# Altium project BaseBoard.PrjPcb (part 1 of 2)
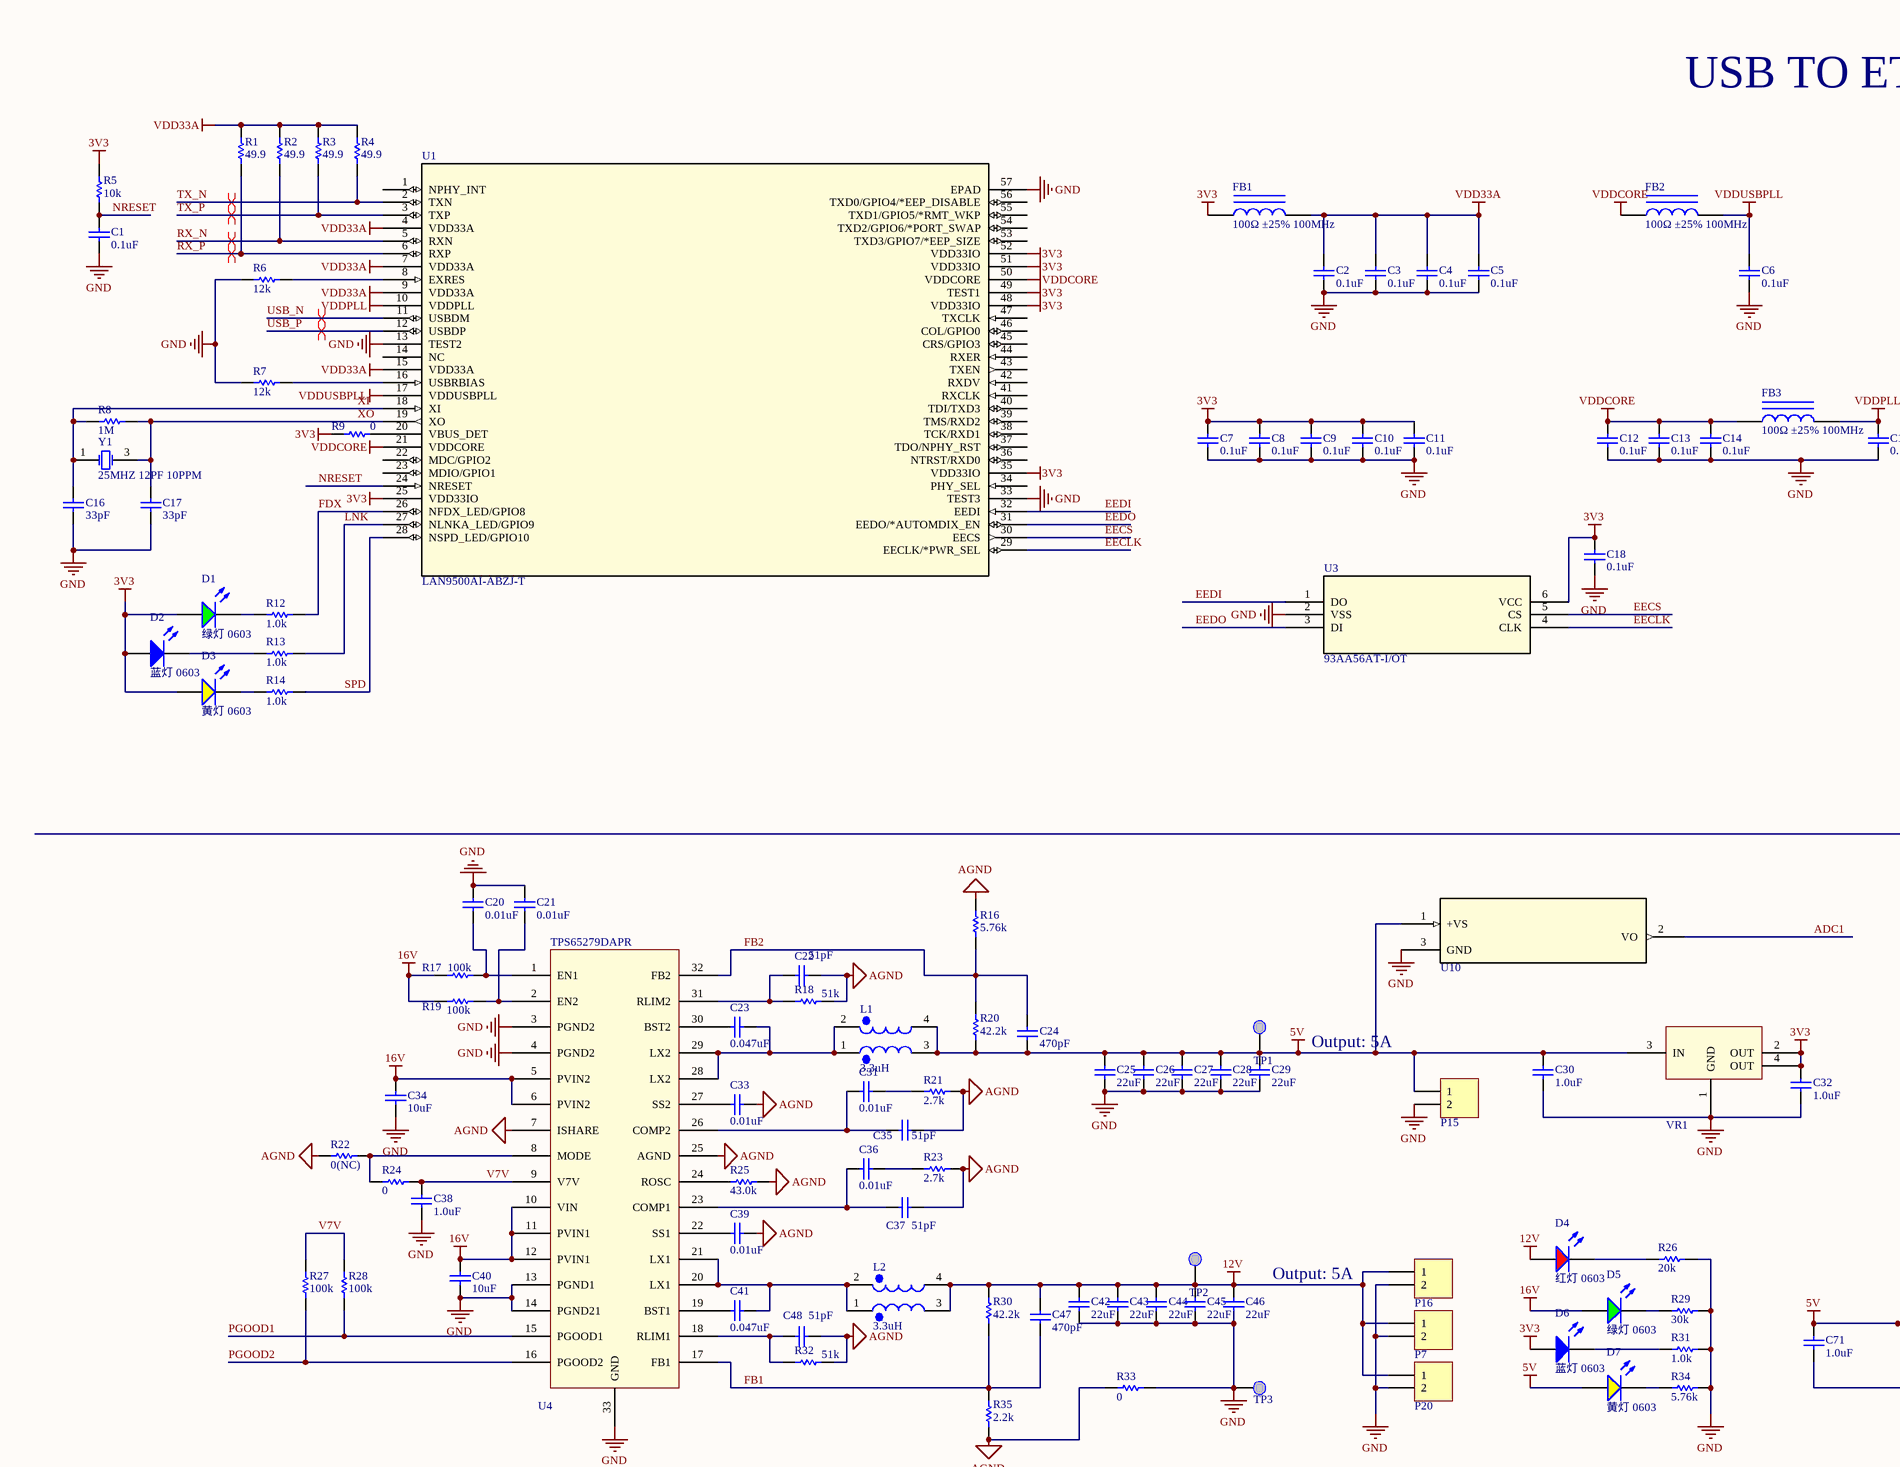
[diagram p0: BaseBoard.SchDoc, top left]
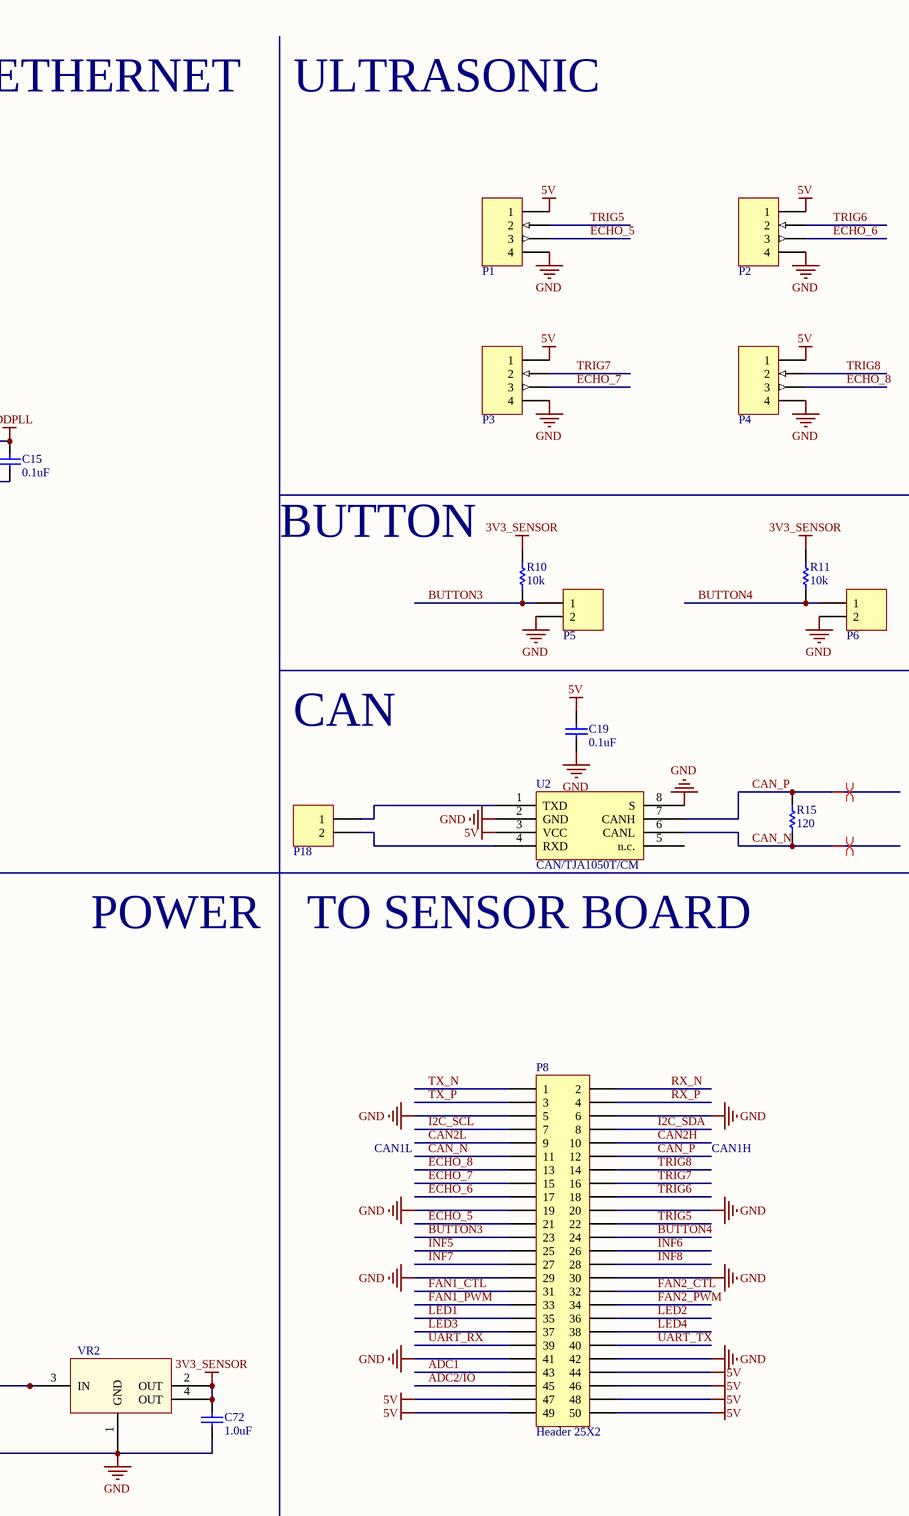
[diagram p1: BaseBoard.SchDoc, top middle]
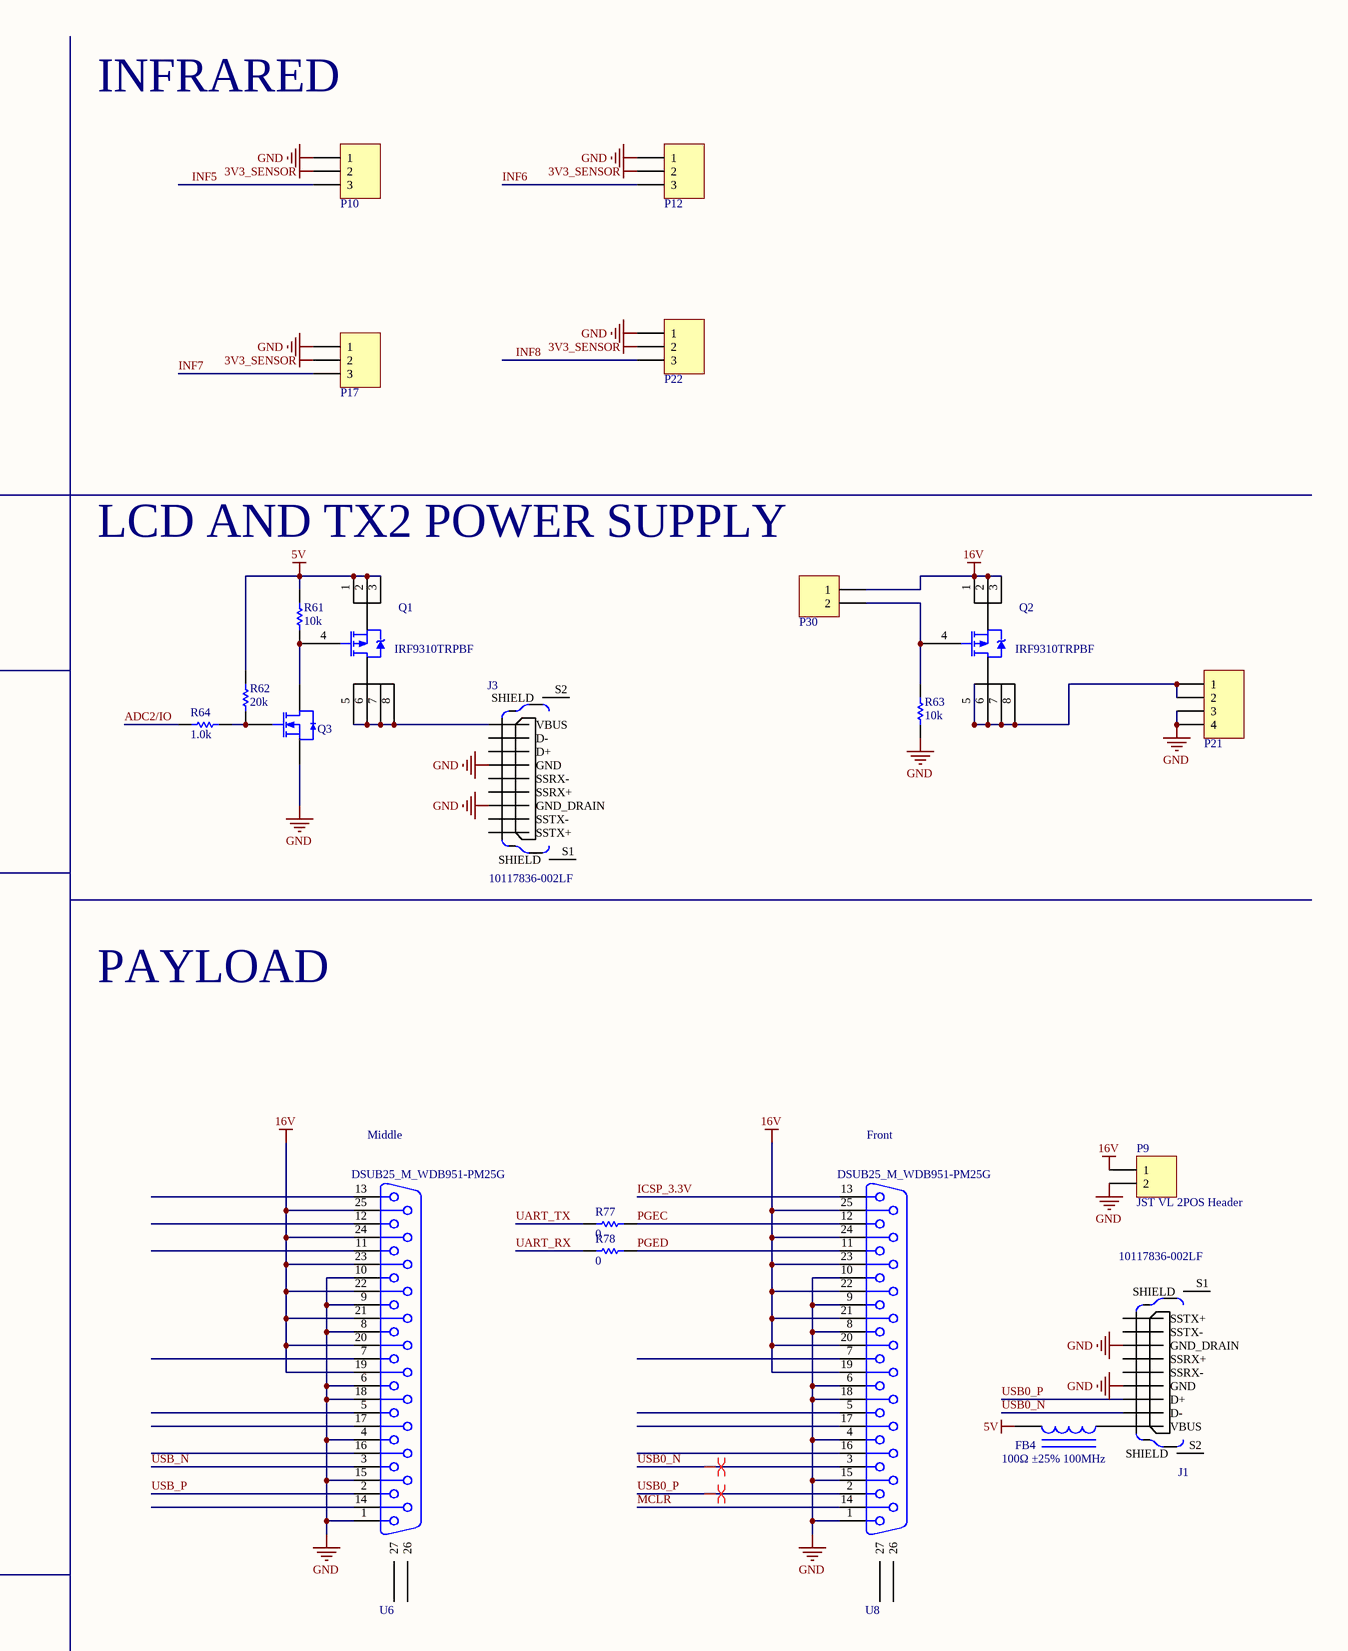
[diagram p2: BaseBoard.SchDoc, top right]
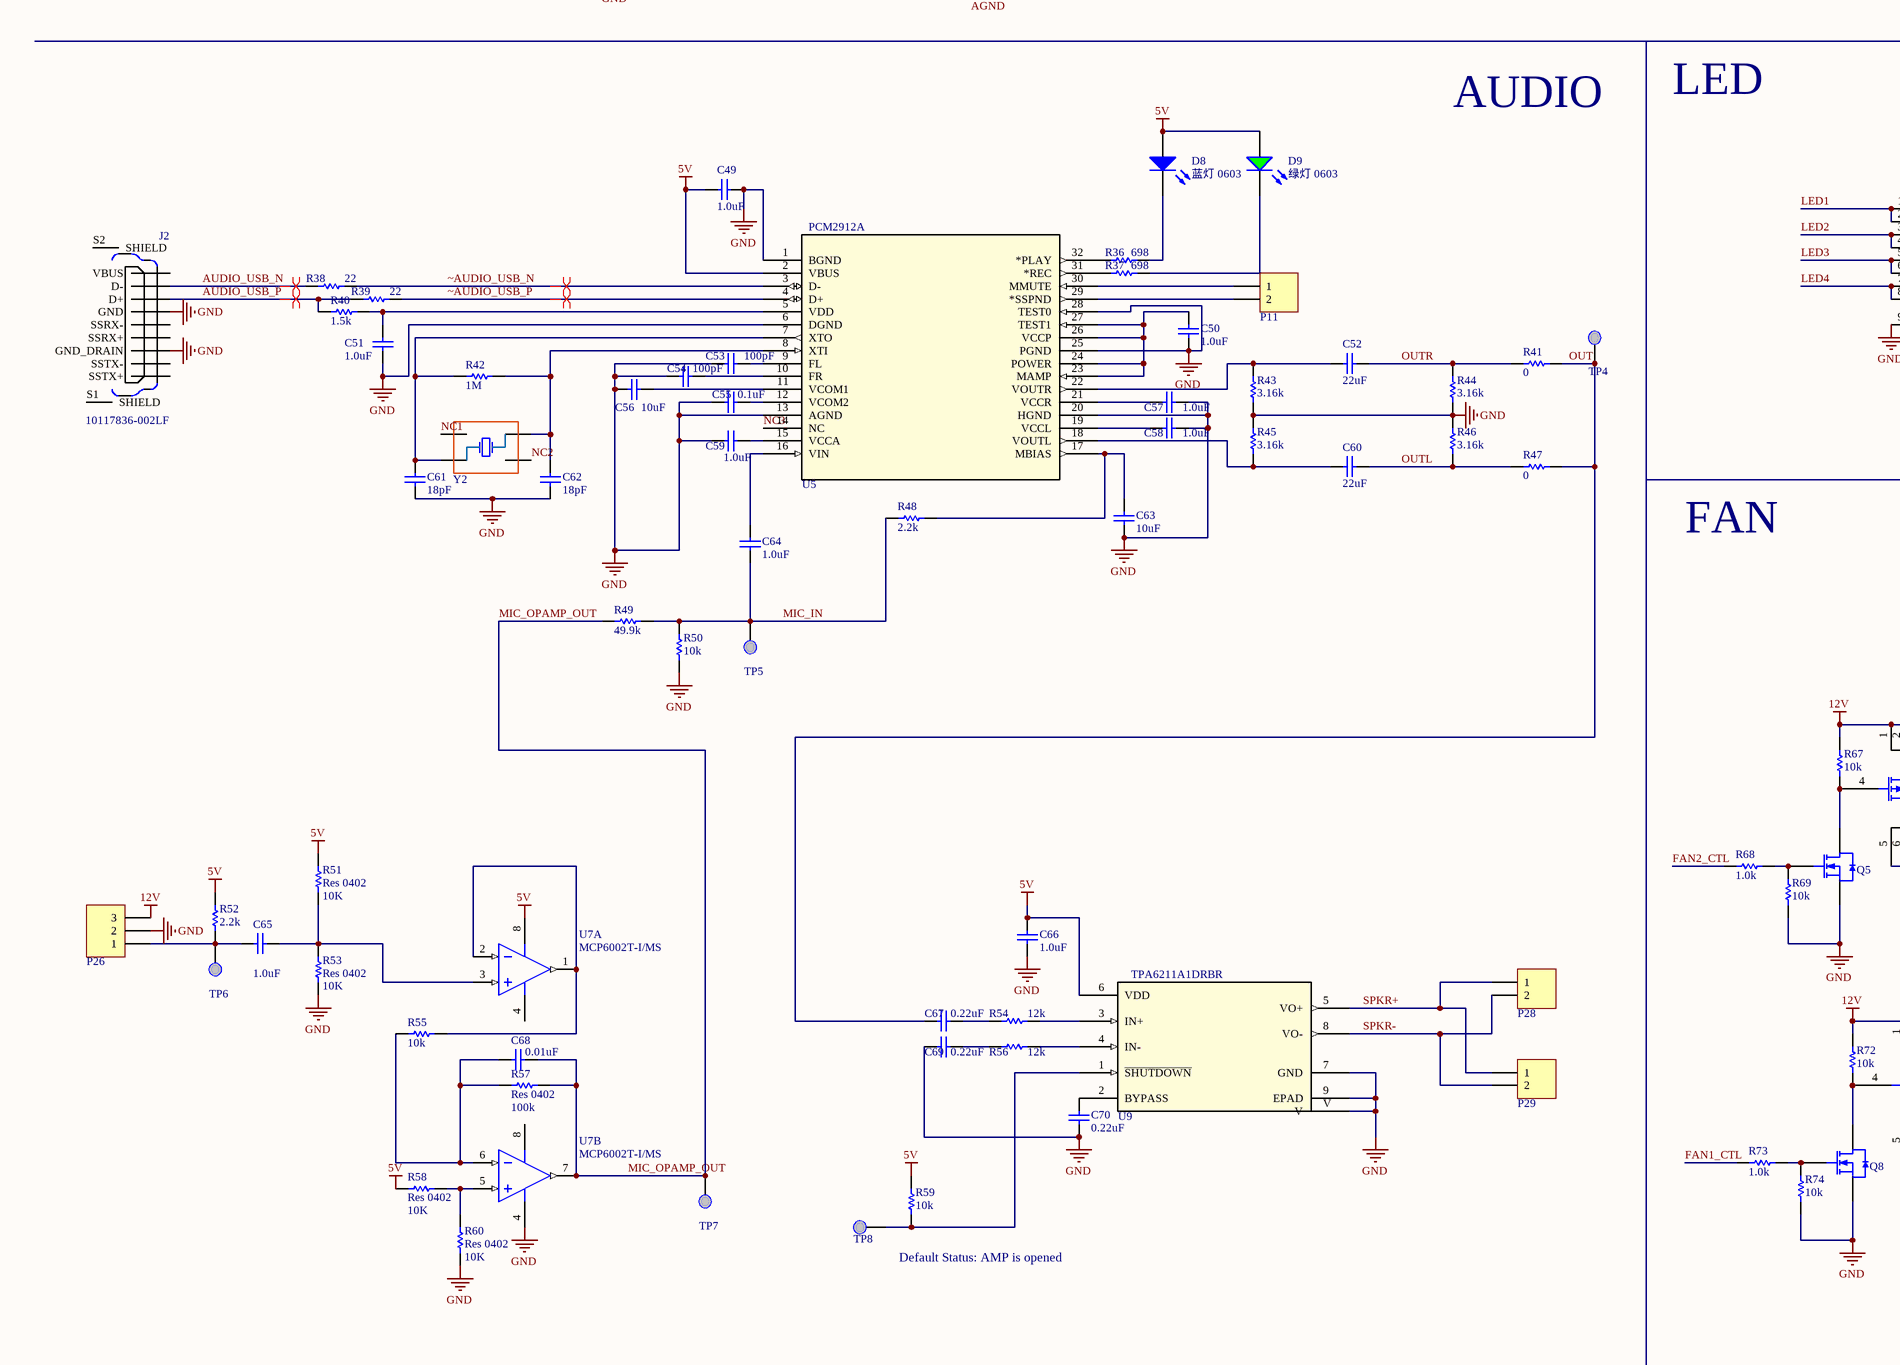
[diagram p3: BaseBoard.SchDoc, bottom left]
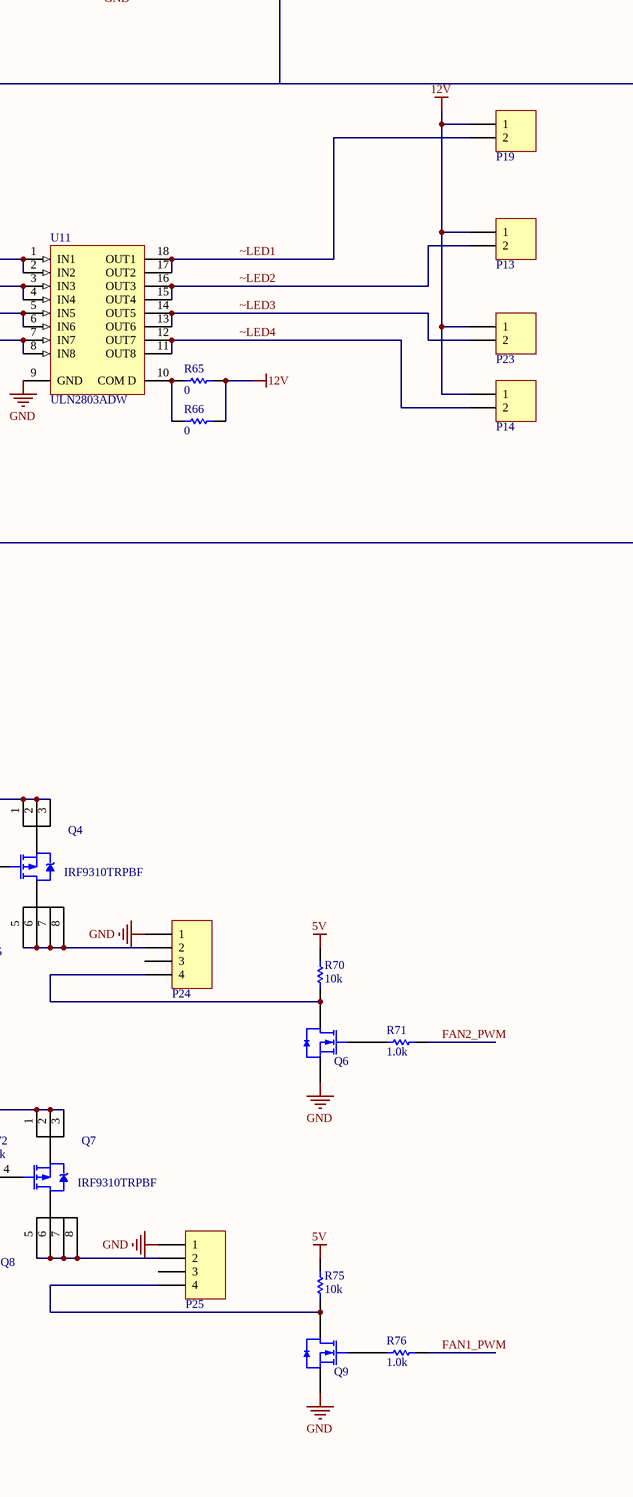
[diagram p4: BaseBoard.SchDoc, bottom middle]
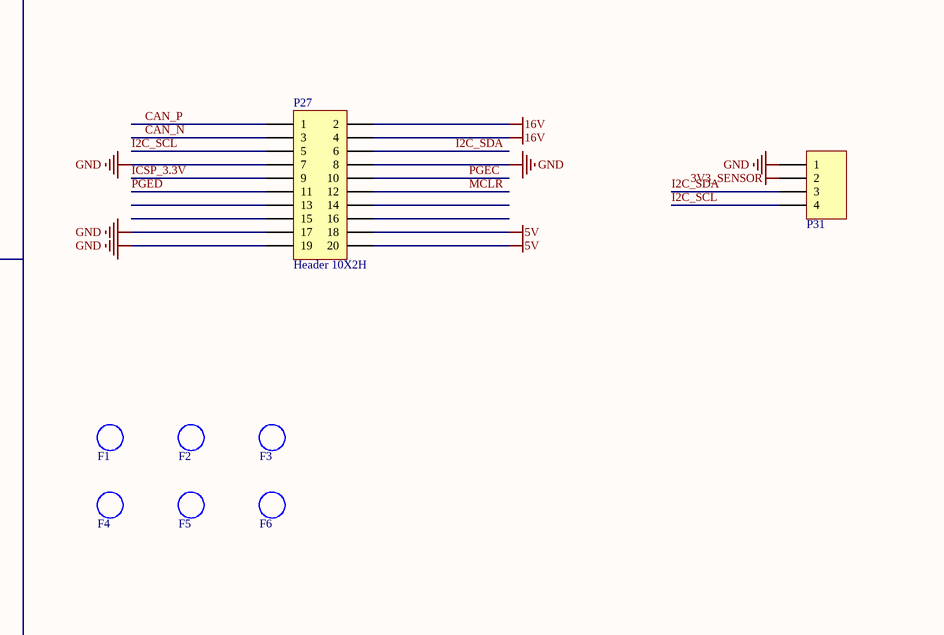
[diagram p5: BaseBoard.SchDoc, bottom right]
1 sheet, 237 parts. Net scope: global (net labels, ports and power ports of the same name join across sheets).
Board file: BaseBoard.PcbDoc

## Sheet BaseBoard.SchDoc
size A1

### Parts
C1  value 0.1uF  [CAP0603N]  (hidden comment: Cap 0603)
C2  value 0.1uF  [CAP0402N]  (hidden comment: Cap 0402)
C3  value 0.1uF  [CAP0402N]  (hidden comment: Cap 0402)
C4  value 0.1uF  [CAP0402N]  (hidden comment: Cap 0402)
C5  value 0.1uF  [CAP0402N]  (hidden comment: Cap 0402)
C6  value 0.1uF  [CAP0402N]  (hidden comment: Cap 0402)
C7  value 0.1uF  [CAP0402N]  (hidden comment: Cap 0402)
C8  value 0.1uF  [CAP0402N]  (hidden comment: Cap 0402)
C9  value 0.1uF  [CAP0402N]  (hidden comment: Cap 0402)
C10  value 0.1uF  [CAP0402N]  (hidden comment: Cap 0402)
C11  value 0.1uF  [CAP0402N]  (hidden comment: Cap 0402)
C12  value 0.1uF  [CAP0402N]  (hidden comment: Cap 0402)
C13  value 0.1uF  [CAP0402N]  (hidden comment: Cap 0402)
C14  value 0.1uF  [CAP0402N]  (hidden comment: Cap 0402)
C15  value 0.1uF  [CAP0402N]  (hidden comment: Cap 0402)
C16  value 33pF  [CAP0402N]  (hidden comment: Cap 0402)
C17  value 33pF  [CAP0402N]  (hidden comment: Cap 0402)
C18  value 0.1uF  [CAP0402N]  (hidden comment: Cap 0402)
C19  value 0.1uF  [CAP0402N]  (hidden comment: Cap 0402)
C20  value 0.01uF  [CAP0402N]  (hidden comment: Cap 0402)
C21  value 0.01uF  [CAP0402N]  (hidden comment: Cap 0402)
C22  value 51pF  [CAP0402N]
C23  value 0.047uF  [CAP0402N]  (hidden comment: Cap 0402)
C24  value 470pF  [CAP0402N]  (hidden comment: Cap 0402)
C25  value 22uF  [CAP1210N]  (hidden comment: Cap 1210)
C26  value 22uF  [CAP1210N]  (hidden comment: Cap 1210)
C27  value 22uF  [CAP1210N]  (hidden comment: Cap 1210)
C28  value 22uF  [CAP1210N]  (hidden comment: Cap 1210)
C29  value 22uF  [CAP1210N]  (hidden comment: Cap 1210)
C30  value 1.0uF  [CAP0805N]  (hidden comment: Cap 0805)
C31  value 0.01uF  [CAP0402N]  (hidden comment: Cap 0402)
C32  value 1.0uF  [CAP0805N]  (hidden comment: Cap 0805)
C33  value 0.01uF  [CAP0402N]  (hidden comment: Cap 0402)
C34  value 10uF  [CAP1206N]  (hidden comment: Cap 1206)
C35  value 51pF  [CAP0402N]
C36  value 0.01uF  [CAP0402N]  (hidden comment: Cap 0402)
C37  value 51pF  [CAP0402N]
C38  value 1.0uF  [CAP0603N]  (hidden comment: Cap 0603)
C39  value 0.01uF  [CAP0402N]  (hidden comment: Cap 0402)
C40  value 10uF  [CAP1206N]  (hidden comment: Cap 1206)
C41  value 0.047uF  [CAP0402N]  (hidden comment: Cap 0402)
C42  value 22uF  [CAP1210N]  (hidden comment: Cap 1210)
C43  value 22uF  [CAP1210N]  (hidden comment: Cap 1210)
C44  value 22uF  [CAP1210N]  (hidden comment: Cap 1210)
C45  value 22uF  [CAP1210N]  (hidden comment: Cap 1210)
C46  value 22uF  [CAP1210N]  (hidden comment: Cap 1210)
C47  value 470pF  [CAP0402N]  (hidden comment: Cap 0402)
C48  value 51pF  [CAP0402N]
C49  value 1.0uF  [CAP0805N]  (hidden comment: Cap 0805)
C50  value 1.0uF  [CAP0805N]  (hidden comment: Cap 0805)
C51  value 1.0uF  [CAP0805N]  (hidden comment: Cap 0805)
C52  value 22uF  [CAP0805N]  (hidden comment: Cap 0805)
C53  value 100pF  [CAP0402N]  (hidden comment: Cap 0402)
C54  value 100pF  [CAP0402N]  (hidden comment: Cap 0402)
C55  value 0.1uF  [CAP0402N]  (hidden comment: Cap 0402)
C56  value 10uF  [CAP0805N]  (hidden comment: Cap 0805)
C57  value 1.0uF  [CAP0805N]  (hidden comment: Cap 0805)
C58  value 1.0uF  [CAP0805N]  (hidden comment: Cap 0805)
C59  value 1.0uF  [CAP0805N]  (hidden comment: Cap 0805)
C60  value 22uF  [CAP0805N]  (hidden comment: Cap 0805)
C61  value 18pF  [CAP0402N]  (hidden comment: Cap 0402)
C62  value 18pF  [CAP0402N]  (hidden comment: Cap 0402)
C63  value 10uF  [CAP0805N]  (hidden comment: Cap 0805)
C64  value 1.0uF  [CAP0805N]  (hidden comment: Cap 0805)
C65  value 1.0uF  [CAP0402N]  (hidden comment: Cap 0402)
C66  value 1.0uF  [CAP0603N]  (hidden comment: Cap 0603)
C67  value 0.22uF  [CAP0402N]  (hidden comment: Cap 0402)
C68  value 0.01uF  [CAP0402N]  (hidden comment: Cap 0402)
C69  value 0.22uF  [CAP0402N]  (hidden comment: Cap 0402)
C70  value 0.22uF  [CAP0402N]  (hidden comment: Cap 0402)
C71  value 1.0uF  [CAP0805N]  (hidden comment: Cap 0805)
C72  value 1.0uF  [CAP0805N]  (hidden comment: Cap 0805)
D1  绿灯 0603  [0603_LED_S1]
D2  蓝灯 0603  [0603_LED_S1]
D3  黄灯 0603  [0603_LED_S1]
D4  红灯 0603  [0603_LED_S1]
D5  绿灯 0603  [0603_LED_S1]
D6  蓝灯 0603  [0603_LED_S1]
D7  黄灯 0603  [0603_LED_S1]
D8  蓝灯 0603  [0603_LED_S1]
D9  绿灯 0603  [0603_LED_S1]
F1  Fiducial, .040"  [FIDUCIAL, .040"]  (value not drawn)  (no BOM)
F2  Fiducial, .040"  [FIDUCIAL, .040"]  (value not drawn)  (no BOM)
F3  Fiducial, .040"  [FIDUCIAL, .040"]  (value not drawn)  (no BOM)
F4  Fiducial, .040"  [FIDUCIAL, .040"]  (value not drawn)  (no BOM)
F5  Fiducial, .040"  [FIDUCIAL, .040"]  (value not drawn)  (no BOM)
F6  Fiducial, .040"  [FIDUCIAL, .040"]  (value not drawn)  (no BOM)
FB1  100Ω ±25% 100MHz  [0805_L]
FB2  100Ω ±25% 100MHz  [0805_L]
FB3  100Ω ±25% 100MHz  [0805_L]
FB4  100Ω ±25% 100MHz  [0805_L]
J1  10117836-002LF  [AMPHENOL_10117836-002LF_10117836-002LF(Primary)]
J2  10117836-002LF  [AMPHENOL_10117836-002LF_10117836-002LF(Primary)]
J3  10117836-002LF  [AMPHENOL_10117836-002LF_10117836-002LF(Primary)]
L1  value 3.3uH  [SRF1280]  (hidden comment: Indc)
L2  value 3.3uH  [SRF1280]  (hidden comment: Indc)
P1  B4B-PH-SM4-TB(LF)(SN)  [B4B-PH-SM4-TB(LF)(SN)]  (value not drawn)
P2  B4B-PH-SM4-TB(LF)(SN)  [B4B-PH-SM4-TB(LF)(SN)]  (value not drawn)
P3  B4B-PH-SM4-TB(LF)(SN)  [B4B-PH-SM4-TB(LF)(SN)]  (value not drawn)
P4  B4B-PH-SM4-TB(LF)(SN)  [B4B-PH-SM4-TB(LF)(SN)]  (value not drawn)
P5  B2B-PH-SM4-TB(LF)(SN)  [B2B-PH-SM4-TB(LF)(SN)]  (value not drawn)
P6  B2B-PH-SM4-TB(LF)(SN)  [B2B-PH-SM4-TB(LF)(SN)]  (value not drawn)
P7  B2B-PH-SM4-TB(LF)(SN)  [B2B-PH-SM4-TB(LF)(SN)]  (value not drawn)
P8  Header 25X2  [HDR_2X25]
P9  JST VL 2POS Header  [JST-VL-2POS]
P10  B3B-PH-SM4-TB(LF)(SN)  [B3B-PH-SM4-TB(LF)(SN)]  (value not drawn)
P11  0.1" 2POS Header SNGL  [2 POS HEADER SINGLE ROW]  (value not drawn)
P12  B3B-PH-SM4-TB(LF)(SN)  [B3B-PH-SM4-TB(LF)(SN)]  (value not drawn)
P13  B2B-PH-SM4-TB(LF)(SN)  [B2B-PH-SM4-TB(LF)(SN)]  (value not drawn)
P14  B2B-PH-SM4-TB(LF)(SN)  [B2B-PH-SM4-TB(LF)(SN)]  (value not drawn)
P15  B2B-PH-SM4-TB(LF)(SN)  [B2B-PH-SM4-TB(LF)(SN)]  (value not drawn)
P16  B2B-PH-SM4-TB(LF)(SN)  [B2B-PH-SM4-TB(LF)(SN)]  (value not drawn)
P17  B3B-PH-SM4-TB(LF)(SN)  [B3B-PH-SM4-TB(LF)(SN)]  (value not drawn)
P18  B2B-PH-SM4-TB(LF)(SN)  [B2B-PH-SM4-TB(LF)(SN)]  (value not drawn)
P19  B2B-PH-SM4-TB(LF)(SN)  [B2B-PH-SM4-TB(LF)(SN)]  (value not drawn)
P20  B2B-PH-SM4-TB(LF)(SN)  [B2B-PH-SM4-TB(LF)(SN)]  (value not drawn)
P21  B4B-PH-SM4-TB(LF)(SN)  [B4B-PH-SM4-TB(LF)(SN)]  (value not drawn)
P22  B3B-PH-SM4-TB(LF)(SN)  [B3B-PH-SM4-TB(LF)(SN)]  (value not drawn)
P23  B2B-PH-SM4-TB(LF)(SN)  [B2B-PH-SM4-TB(LF)(SN)]  (value not drawn)
P24  B4B-PH-SM4-TB(LF)(SN)  [B4B-PH-SM4-TB(LF)(SN)]  (value not drawn)
P25  B4B-PH-SM4-TB(LF)(SN)  [B4B-PH-SM4-TB(LF)(SN)]  (value not drawn)
P26  B3B-PH-SM4-TB(LF)(SN)  [B3B-PH-SM4-TB(LF)(SN)]  (value not drawn)
P27  Header 10X2H  [HDR_2X10]
P28  B2B-PH-SM4-TB(LF)(SN)  [B2B-PH-SM4-TB(LF)(SN)]  (value not drawn)
P29  B2B-PH-SM4-TB(LF)(SN)  [B2B-PH-SM4-TB(LF)(SN)]  (value not drawn)
P30  B2B-PH-SM4-TB(LF)(SN)  [B2B-PH-SM4-TB(LF)(SN)]  (value not drawn)
P31  B4B-PH-SM4-TB(LF)(SN)  [B4B-PH-SM4-TB(LF)(SN)]  (value not drawn)
Q1  IRF9310TRPBF  [SOIC-SN8_M]
Q2  IRF9310TRPBF  [SOIC-SN8_M]
Q3  AO3400A N道沟 X0YV1T SOT-23  [SOT-23-3L]  (value not drawn)
Q4  IRF9310TRPBF  [SOIC-SN8_M]
Q5  AO3400A N道沟 X0YV1T SOT-23  [SOT-23-3L]  (value not drawn)
Q6  AO3400A N道沟 X0YV1T SOT-23  [SOT-23-3L]  (value not drawn)
Q7  IRF9310TRPBF  [SOIC-SN8_M]
Q8  AO3400A N道沟 X0YV1T SOT-23  [SOT-23-3L]  (value not drawn)
Q9  AO3400A N道沟 X0YV1T SOT-23  [SOT-23-3L]  (value not drawn)
R1  value 49.9  [RES0603N]  (hidden comment: Res 0603)
R2  value 49.9  [RES0603N]  (hidden comment: Res 0603)
R3  value 49.9  [RES0603N]  (hidden comment: Res 0603)
R4  value 49.9  [RES0603N]  (hidden comment: Res 0603)
R5  value 10k  [RES0603N]  (hidden comment: Res 0603)
R6  value 12k  [RES0603N]  (hidden comment: Res 0603)
R7  value 12k  [RES0603N]  (hidden comment: Res 0603)
R8  value 1M  [RES0402N]  (hidden comment: Res 0402)
R9  value 0  [RES0603N]  (hidden comment: Res 0603)
R10  value 10k  [RES0603N]  (hidden comment: Res 0603)
R11  value 10k  [RES0603N]  (hidden comment: Res 0603)
R12  value 1.0k  [RES0603N]  (hidden comment: Res 0603)
R13  value 1.0k  [RES0603N]  (hidden comment: Res 0603)
R14  value 1.0k  [RES0603N]  (hidden comment: Res 0603)
R15  value 120  [RES0603N]  (hidden comment: Res 0603)
R16  value 5.76k  [RES0402N]  (hidden comment: Res 0402)
R17  value 100k  [RES0603N]  (hidden comment: Res 0603)
R18  value 51k  [RES0402N]  (hidden comment: Res 0402)
R19  value 100k  [RES0603N]  (hidden comment: Res 0603)
R20  value 42.2k  [RES0402N]  (hidden comment: Res 0402)
R21  value 2.7k  [RES0603N]  (hidden comment: Res 0603)
R22  value 0(NC)  [RES0603N]  (hidden comment: Res 0603)
R23  value 2.7k  [RES0603N]  (hidden comment: Res 0603)
R24  value 0  [RES0603N]  (hidden comment: Res 0603)
R25  value 43.0k  [RES0603N]  (hidden comment: Res 0603)
R26  value 20k  [RES0603N]  (hidden comment: Res 0603)
R27  value 100k  [RES0603N]  (hidden comment: Res 0603)
R28  value 100k  [RES0603N]  (hidden comment: Res 0603)
R29  value 30k  [RES0603N]  (hidden comment: Res 0603)
R30  value 42.2k  [RES0402N]  (hidden comment: Res 0402)
R31  value 1.0k  [RES0603N]  (hidden comment: Res 0603)
R32  value 51k  [RES0402N]  (hidden comment: Res 0402)
R33  value 0  [RES0805N]  (hidden comment: Res 0805)
R34  value 5.76k  [RES0603N]  (hidden comment: Res 0603)
R35  value 2.2k  [RES0402N]  (hidden comment: Res 0402)
R36  value 698  [RES0805N]  (hidden comment: Res 0805)
R37  value 698  [RES0805N]  (hidden comment: Res 0805)
R38  value 22  [RES0402N]  (hidden comment: Res 0402)
R39  value 22  [RES0402N]  (hidden comment: Res 0402)
R40  value 1.5k  [RES0402N]  (hidden comment: Res 0402)
R41  value 0  [RES0402N]  (hidden comment: Res 0402)
R42  value 1M  [RES0402N]  (hidden comment: Res 0402)
R43  value 3.16k  [RES0402N]  (hidden comment: Res 0402)
R44  value 3.16k  [RES0402N]  (hidden comment: Res 0402)
R45  value 3.16k  [RES0402N]  (hidden comment: Res 0402)
R46  value 3.16k  [RES0402N]  (hidden comment: Res 0402)
R47  value 0  [RES0402N]  (hidden comment: Res 0402)
R48  value 2.2k  [RES0402N]  (hidden comment: Res 0402)
R49  value 49.9k  [RES0603N]  (hidden comment: Res 0603)
R50  value 10k  [RES0603N]  (hidden comment: Res 0603)
R51  Res 0402  value 10K  [RES0402N]
R52  value 2.2k  [RES0402N]  (hidden comment: Res 0402)
R53  Res 0402  value 10K  [RES0402N]
R54  value 12k  [RES0603N]  (hidden comment: Res 0603)
R55  value 10k  [RES0603N]  (hidden comment: Res 0603)
R56  value 12k  [RES0603N]  (hidden comment: Res 0603)
R57  Res 0402  value 100k  [RES0402N]
R58  Res 0402  value 10K  [RES0402N]
R59  value 10k  [RES0603N]  (hidden comment: Res 0603)
R60  Res 0402  value 10K  [RES0402N]
R61  value 10k  [RES0603N]  (hidden comment: Res 0603)
R62  value 20k  [RES0603N]  (hidden comment: Res 0603)
R63  value 10k  [RES0603N]  (hidden comment: Res 0603)
R64  value 1.0k  [RES0603N]  (hidden comment: Res 0603)
R65  value 0  [RES0805N]  (hidden comment: Res 0805)
R66  value 0  [RES0805N]  (hidden comment: Res 0805)
R67  value 10k  [RES0603N]  (hidden comment: Res 0603)
R68  value 1.0k  [RES0603N]  (hidden comment: Res 0603)
R69  value 10k  [RES0603N]  (hidden comment: Res 0603)
R70  value 10k  [RES0603N]  (hidden comment: Res 0603)
R71  value 1.0k  [RES0603N]  (hidden comment: Res 0603)
R72  value 10k  [RES0603N]  (hidden comment: Res 0603)
R73  value 1.0k  [RES0603N]  (hidden comment: Res 0603)
R74  value 10k  [RES0603N]  (hidden comment: Res 0603)
R75  value 10k  [RES0603N]  (hidden comment: Res 0603)
R76  value 1.0k  [RES0603N]  (hidden comment: Res 0603)
R77  value 0  [RES0603N]  (hidden comment: Res 0603)
R78  value 0  [RES0603N]  (hidden comment: Res 0603)
TP1  Test Point, 60mil  [test_point_60_mil]  (value not drawn)
TP2  Test Point, 60mil  [test_point_60_mil]  (value not drawn)
TP3  Test Point, 60mil  [test_point_60_mil]  (value not drawn)
TP4  Test Point, 60mil  [test_point_60_mil]  (value not drawn)
TP5  Test Point, 60mil  [test_point_60_mil]  (value not drawn)
TP6  Test Point, 60mil  [test_point_60_mil]  (value not drawn)
TP7  Test Point, 60mil  [test_point_60_mil]  (value not drawn)
TP8  Test Point, 60mil  [test_point_60_mil]  (value not drawn)
U1  LAN9500AI-ABZJ-T  [QFN56_8X8MC-M]
U2  CAN/TJA1050T/CM  [SOIC-8_150mil]
U3  93AA56AT-I/OT  [SOT-23-6_MC-M]
U4  TPS65279DAPR  [DAD32-M]
U5  PCM2912A  [PJT32-M]
U6  DSUB25_M_WDB951-PM25G  [DSUB25_M_WDB951-PM25G]
U7  MCP6002T-I/MS  [MSOP-MS8_N]  (parts A,B of 2)
U8  DSUB25_M_WDB951-PM25G  [DSUB25_M_WDB951-PM25G]
U9  TPA6211A1DRBR  [DRB8_1P75X1P5]
U10  LM50CIM3/NOPB  [MF03A-M]  (value not drawn)
U11  ULN2803ADW  [SOIC-18_300mil]
VR1  AZ1117EH-3.3TRG1  [SOT-223]  (value not drawn)
VR2  AZ1117EH-3.3TRG1  [SOT-223]  (value not drawn)
Y1  25MHZ 12PF 10PPM  [SMD-3225_4P]
Y2  ABMM-6.000MHZ-B2-T  [SMD-7050_4P]  (value not drawn)

### Nets
3V3: C7.2 C8.2 C9.2 C10.2 C11.2 C18.2 C32.2 D1.A D2.A D3.A D6.A FB1.1 R5.2 R9.1 U1.25(VDD33IO) U1.35(VDD33IO) U1.48(VDD33IO) U1.49(TEST1) U1.51(VDD33IO) U1.52(VDD33IO) U3.6(VCC) VR1.2(OUT) VR1.4(OUT)
3V3_SENSOR: C72.2 P10.2 P12.2 P17.2 P22.2 P31.2 R10.2 R11.2 VR2.2(OUT) VR2.4(OUT)
5V: C19.2 C24.1 C25.2 C26.2 C27.2 C28.2 C29.2 C30.2 C49.1 C66.2 C71.2 D7.A D8.A D9.A FB4.2 L1.3 L1.4 P1.1 P2.1 P3.1 P4.1 P8.44 P8.46 P8.47 P8.48 P8.49 P8.50 P15.1 P27.18 P27.20 Q1.1(G) Q1.2(D) Q1.3(S) R20.1 R51.1 R52.2 R58.1 R59.2 R61.2 R62.2 R70.2 R75.2 TP1.0 U2.3(VCC) U5.2(VBUS) U7.8(VDD) U9.6(VDD) U10.1(+VS) VR1.3(IN) VR2.3(IN)
12V: C42.2 C43.2 C44.2 C45.2 C46.2 C47.2 D4.A L2.3 L2.4 P7.1 P13.1 P14.1 P16.1 P19.1 P20.1 P23.1 P26.3 Q4.1(G) Q4.2(D) Q4.3(S) Q7.1(G) Q7.2(D) Q7.3(S) R30.2 R65.2 R66.2 R67.2 R72.2 TP2.0
16V: C34.2 C40.2 D5.A P9.1 P27.2 P27.4 P30.1 Q2.1(G) Q2.2(D) Q2.3(S) R17.1 R19.1 U4.5(PVIN2) U4.6(PVIN2) U4.10(VIN) U4.11(PVIN1) U4.12(PVIN1) U6.19 U6.20 U6.21 U6.22 U6.23 U6.24 U6.25 U8.19 U8.20 U8.21 U8.22 U8.23 U8.24 U8.25
AGND: C22.2 C33.1 C35.2 C37.2 C39.1 C48.2 R16.2 R18.2 R21.2 R22.2 R23.2 R25.2 R32.2 R33.1 R35.1 U4.7(ISHARE) U4.25(AGND)
GND: C1.1 C2.1 C3.1 C4.1 C5.1 C6.1 C7.1 C8.1 C9.1 C10.1 C11.1 C12.1 C13.1 C14.1 C15.1 C16.1 C17.1 C18.1 C19.1 C20.2 C21.2 C25.1 C26.1 C27.1 C28.1 C29.1 C30.1 C32.1 C34.1 C38.1 C40.1 C42.1 C43.1 C44.1 C45.1 C46.1 C49.2 C50.1 C51.1 C53.1 C54.1 C55.1 C56.1 C57.2 C58.2 C59.1 C61.1 C62.1 C63.1 C66.1 C69.2 C70.1 C71.1 C72.1 J1.4(GND) J1.7(GND_DRAIN) J2.4(GND) J2.7(GND_DRAIN) J3.4(GND) J3.7(GND_DRAIN) P1.4 P2.4 P3.4 P4.4 P5.2 P6.2 P7.2 P8.5 P8.6 P8.19 P8.20 P8.29 P8.30 P8.41 P8.42 P9.2 P10.1 P12.1 P15.2 P16.2 P17.1 P20.2 P21.3 P21.4 P22.1 P24.1 P25.1 P26.2 P27.7 P27.8 P27.17 P27.19 P31.1 Q3.2(S) Q5.2(S) Q6.2(S) Q8.2(S) Q9.2(S) R6.1 R7.1 R26.2 R29.2 R31.2 R33.2 R34.2 R43.1 R44.1 R45.2 R46.2 R50.1 R53.2 R60.1 R63.1 R69.1 R74.1 TP3.0 U1.13(TEST2) U1.33(TEST3) U1.57(EPAD) U2.2(GND) U2.8(S) U3.2(VSS) U4.3(PGND2) U4.4(PGND2) U4.13(PGND1) U4.14(PGND21) U4.33(GND) U5.1(BGND) U5.6(DGND) U5.13(AGND) U5.20(HGND) U5.25(PGND) U5.28(TEST0) U6.1 U6.4 U6.6 U6.8 U6.9 U6.10 U6.15 U6.18 U7.4(VSS) U8.1 U8.4 U8.6 U8.8 U8.9 U8.10 U8.15 U8.18 U9.7(GND) U9.9(EPAD) U9.V U10.3(GND) U11.9(GND) VR1.1(GND) VR2.1(GND)
VDD33A: C2.2 C3.2 C4.2 C5.2 FB1.2 R1.2 R2.2 R3.2 R4.2 U1.4(VDD33A) U1.7(VDD33A) U1.9(VDD33A) U1.15(VDD33A)
VDDCORE: C12.2 C13.2 C14.2 FB2.1 FB3.1 U1.21(VDDCORE) U1.50(VDDCORE)
VDDPLL: C15.2 FB3.2 U1.10(VDDPLL)
VDDUSBPLL: C6.2 FB2.2 U1.17(VDDUSBPLL)
ADC1: P8.43 U10.2(VO)
ADC2/IO: P8.45 R64.1
AUDIO_USB_N: J2.2(D-) R38.1
AUDIO_USB_P: J2.3(D+) R39.1 R40.1
BUTTON3: P5.1 P8.23 R10.1
BUTTON4: P6.1 P8.24 R11.1
CAN2H: P8.10
CAN2L: P8.9
CAN_N: P8.11 P27.3 R15.1 U2.6(CANL)
CAN_P: P8.12 P27.1 R15.2 U2.7(CANH)
ECHO_5: P1.3 P8.21
ECHO_6: P2.3 P8.17
ECHO_7: P3.3 P8.15
ECHO_8: P4.3 P8.13
EECLK: U1.29(EECLK/*PWR_SEL) U3.4(CLK)
EECS: U1.30(EECS) U3.5(CS)
EEDI: U1.32(EEDI) U3.1(DO)
EEDO: U1.31(EEDO/*AUTOMDIX_EN) U3.3(DI)
FAN1_CTL: P8.31 R73.1
FAN1_PWM: P8.33 R76.2
FAN2_CTL: P8.32 R68.1
FAN2_PWM: P8.34 R71.2
FB1: C47.1 R30.1 R35.2 U4.17(FB1)
FB2: C24.2 R16.1 R20.2 U4.32(FB2)
FDX: R12.2 U1.26(NFDX_LED/GPIO8)
I2C_SCL: P8.7 P27.5 P31.4
I2C_SDA: P8.8 P27.6 P31.3
ICSP_3.3V: P27.9 U8.13
INF5: P8.25 P10.3
INF6: P8.26 P12.3
INF7: P8.27 P17.3
INF8: P8.28 P22.3
LED1: P8.35 U11.1(IN1) U11.2(IN2)
LED2: P8.36 U11.3(IN3) U11.4(IN4)
LED3: P8.37 U11.5(IN5) U11.6(IN6)
LED4: P8.38 U11.7(IN7) U11.8(IN8)
LNK: R13.2 U1.27(NLNKA_LED/GPIO9)
MCLR: P27.12 U8.14
MIC_IN: C64.1 R48.1 R49.2 R50.2 TP5.0
MIC_OPAMP_OUT: C68.2 R49.1 R57.1 TP7.0 U7.7(VOUTB)
NC1: Y2.4(NC)
NC2: Y2.2(NC)
NC3: U5.14(NC)
NRESET: C1.2 R5.1 U1.24(NRESET)
OUT: C67.2 R41.2 R47.2 TP4.0
OUTL: C60.2 R46.1 R47.1
OUTR: C52.2 R41.1 R44.2
PGEC: P27.10 R77.2 U8.12
PGED: P27.11 R78.2 U8.11
PGOOD1: R28.1 U4.15(PGOOD1)
PGOOD2: R27.1 U4.16(PGOOD2)
RX_N: P8.2 R2.1 U1.5(RXN)
RX_P: P8.4 R1.1 U1.6(RXP)
SPD: R14.2 U1.28(NSPD_LED/GPIO10)
SPKR+: P28.1 P29.1 U9.5(VO+)
SPKR-: P28.2 P29.2 U9.8(VO-)
TRIG5: P1.2 P8.22
TRIG6: P2.2 P8.18
TRIG7: P3.2 P8.16
TRIG8: P4.2 P8.14
TX_N: P8.1 R4.1 U1.2(TXN)
TX_P: P8.3 R3.1 U1.3(TXP)
UART_RX: P8.39 R78.1
UART_TX: P8.40 R77.1
USB0_N: J1.2(D-) U8.3
USB0_P: J1.3(D+) U8.2
USB_N: U1.11(USBDM) U6.3
USB_P: U1.12(USBDP) U6.2
V7V: C38.2 R24.2 R27.2 R28.2 U4.9(V7V)
XI: C16.2 R8.1 U1.18(XI) Y1.1(OSC1)
XO: C17.2 R8.2 U1.19(XO) Y1.3(OSC2)
~AUDIO_USB_N: R38.2 U5.3(D-)
~AUDIO_USB_P: R39.2 U5.4(D+)
~LED1: P19.2 U11.17(OUT2) U11.18(OUT1)
~LED2: P13.2 U11.15(OUT4) U11.16(OUT3)
~LED3: P23.2 U11.13(OUT6) U11.14(OUT5)
~LED4: P14.2 U11.11(OUT8) U11.12(OUT7)
NetC20_1: C20.1 R17.2 U4.1(EN1)
NetC21_1: C21.1 R19.2 U4.2(EN2)
NetC22_1: C22.1 R18.1 U4.31(RLIM2)
NetC23_1: C23.1 U4.30(BST2)
NetC23_2: C23.2 L1.1 L1.2 U4.28(LX2) U4.29(LX2)
NetC31_1: C31.1 R21.1
NetC31_2: C31.2 C35.1 U4.26(COMP2)
NetC33_2: C33.2 U4.27(SS2)
NetC36_1: C36.1 R23.1
NetC36_2: C36.2 C37.1 U4.23(COMP1)
NetC39_2: C39.2 U4.22(SS1)
NetC41_1: C41.1 U4.19(BST1)
NetC41_2: C41.2 L2.1 L2.2 U4.20(LX1) U4.21(LX1)
NetC48_1: C48.1 R32.1 U4.18(RLIM1)
NetC50_2: C50.2 U5.23(MAMP) U5.24(POWER) U5.26(VCCP) U5.27(TEST1)
NetC51_2: C51.2 R40.2 U5.5(VDD)
NetC52_1: C52.1 R43.2 U5.22(VOUTR)
NetC53_2: C53.2 U5.9(FL)
NetC54_2: C54.2 U5.10(FR)
NetC55_2: C55.2 U5.12(VCOM2)
NetC56_2: C56.2 U5.11(VCOM1)
NetC57_1: C57.1 U5.21(VCCR)
NetC58_1: C58.1 U5.19(VCCL)
NetC59_2: C59.2 U5.15(VCCA)
NetC60_1: C60.1 R45.1 U5.18(VOUTL)
NetC61_2: C61.2 R42.1 U5.7(XTO) Y2.3(OSC2)
NetC62_2: C62.2 R42.2 U5.8(XTI) Y2.1(OSC1)
NetC63_2: C63.2 R48.2 U5.17(MBIAS)
NetC64_2: C64.2 U5.16(VIN)
NetC65_1: C65.1 R51.2 R53.1 U7.3(VINA+)
NetC65_2: C65.2 P26.1 R52.1 TP6.0
NetC67_1: C67.1 R54.1
NetC68_1: C68.1 R55.1 R57.2 U7.6(VINB-)
NetC69_1: C69.1 R56.1
NetC70_2: C70.2 U9.2(BYPASS)
NetD1_K: D1.K R12.1
NetD2_K: D2.K R13.1
NetD3_K: D3.K R14.1
NetD4_K: D4.K R26.1
NetD5_K: D5.K R29.1
NetD6_K: D6.K R31.1
NetD7_K: D7.K R34.1
NetD8_K: D8.K R36.2
NetD9_K: D9.K R37.2
NetFB4_1: FB4.1 J1.1(VBUS)
NetJ3_1: J3.1(VBUS) Q1.5 Q1.6 Q1.7 Q1.8
NetP11_1: P11.1 U5.30(MMUTE)
NetP11_2: P11.2 U5.29(*SSPND)
NetP18_1: P18.1 U2.1(TXD)
NetP18_2: P18.2 U2.4(RXD)
NetP21_1: P21.1 P21.2 Q2.5 Q2.6 Q2.7 Q2.8
NetP24_2: P24.2 Q4.5 Q4.6 Q4.7 Q4.8
NetP24_4: P24.4 Q6.3(D) R70.1
NetP25_2: P25.2 Q7.5 Q7.6 Q7.7 Q7.8
NetP25_4: P25.4 Q9.3(D) R75.1
NetP30_2: P30.2 Q2.4 R63.2
NetQ1_4: Q1.4 Q3.3(D) R61.1
NetQ3_1: Q3.1(G) R62.1 R64.2
NetQ4_4: Q4.4 Q5.3(D) R67.1
NetQ5_1: Q5.1(G) R68.2 R69.2
NetQ6_1: Q6.1(G) R71.1
NetQ7_4: Q7.4 Q8.3(D) R72.1
NetQ8_1: Q8.1(G) R73.2 R74.2
NetQ9_1: Q9.1(G) R76.1
NetR6_2: R6.2 U1.8(EXRES)
NetR7_2: R7.2 U1.16(USBRBIAS)
NetR9_2: R9.2 U1.20(VBUS_DET)
NetR22_1: R22.1 R24.1 U4.8(MODE)
NetR25_1: R25.1 U4.24(ROSC)
NetR36_1: R36.1 U5.32(*PLAY)
NetR37_1: R37.1 U5.31(*REC)
NetR54_2: R54.2 U9.3(IN+)
NetR55_2: R55.2 U7.1(VOUTA) U7.2(VINA-)
NetR56_2: R56.2 U9.4(IN-)
NetR58_2: R58.2 R60.2 U7.5(VINB+)
NetR59_1: R59.1 TP8.0 U9.1(~{SHUTDOWN})
NetR65_1: R65.1 R66.1 U11.10(COM_D)

Not connected (* = marked no-connect by the designer): J1 5(SSRX-) 6(SSRX+) 8(SSTX-) 9(SSTX+) S1(SHIELD) S2(SHIELD); J2 1(VBUS) 5(SSRX-) 6(SSRX+) 8(SSTX-) 9(SSTX+) S1(SHIELD) S2(SHIELD); J3 2(D-) 3(D+) 5(SSRX-) 6(SSRX+) 8(SSTX-) 9(SSTX+) S1(SHIELD) S2(SHIELD); P24 3; P25 3; P27 13 14 15 16; U1 1(NPHY_INT) 14(NC) 22(MDC/GPIO2) 23(MDIO/GPIO1) 34(PHY_SEL) 36(NTRST/RXD0) 37(TDO/NPHY_RST) 38(TCK/RXD1) 39(TMS/RXD2) 40(TDI/TXD3) 41(RXCLK) 42(RXDV) 43(TXEN) 44(RXER) 45(CRS/GPIO3) 46(COL/GPIO0) 47(TXCLK) 53(TXD3/GPIO7/*EEP_SIZE) 54(TXD2/GPIO6/*PORT_SWAP) 55(TXD1/GPIO5/*RMT_WKP) 56(TXD0/GPIO4/*EEP_DISABLE); U2 5(n.c.); U6 5 7 11 12 13 14 16 17 26 27; U8 5 7 16 17 26 27

### Layout directives
differential pair: AUDIO_USB_N, AUDIO_USB_P, CAN_N, CAN_P, RX_N, RX_P, TX_N, TX_P, USB0_N, USB0_P, USB_N, USB_P, ~AUDIO_USB_N, ~AUDIO_USB_P

### Notes on the sheet
- USB TO ETHERNET
- ULTRASONIC
- INFRARED
- BUTTON
- LCD AND TX2 POWER SUPPLY
- CAN
- POWER
- TO SENSOR BOARD
- PAYLOAD
- Output: 5A
- Middle
- Front
- CAN1L
- CAN1H
- AUDIO
- LED
- FAN
- Default Status: AMP is opened